# Altium schematic sheet 02 BLOCK DIAGRAM.SchDoc
size 513 x 386 mm
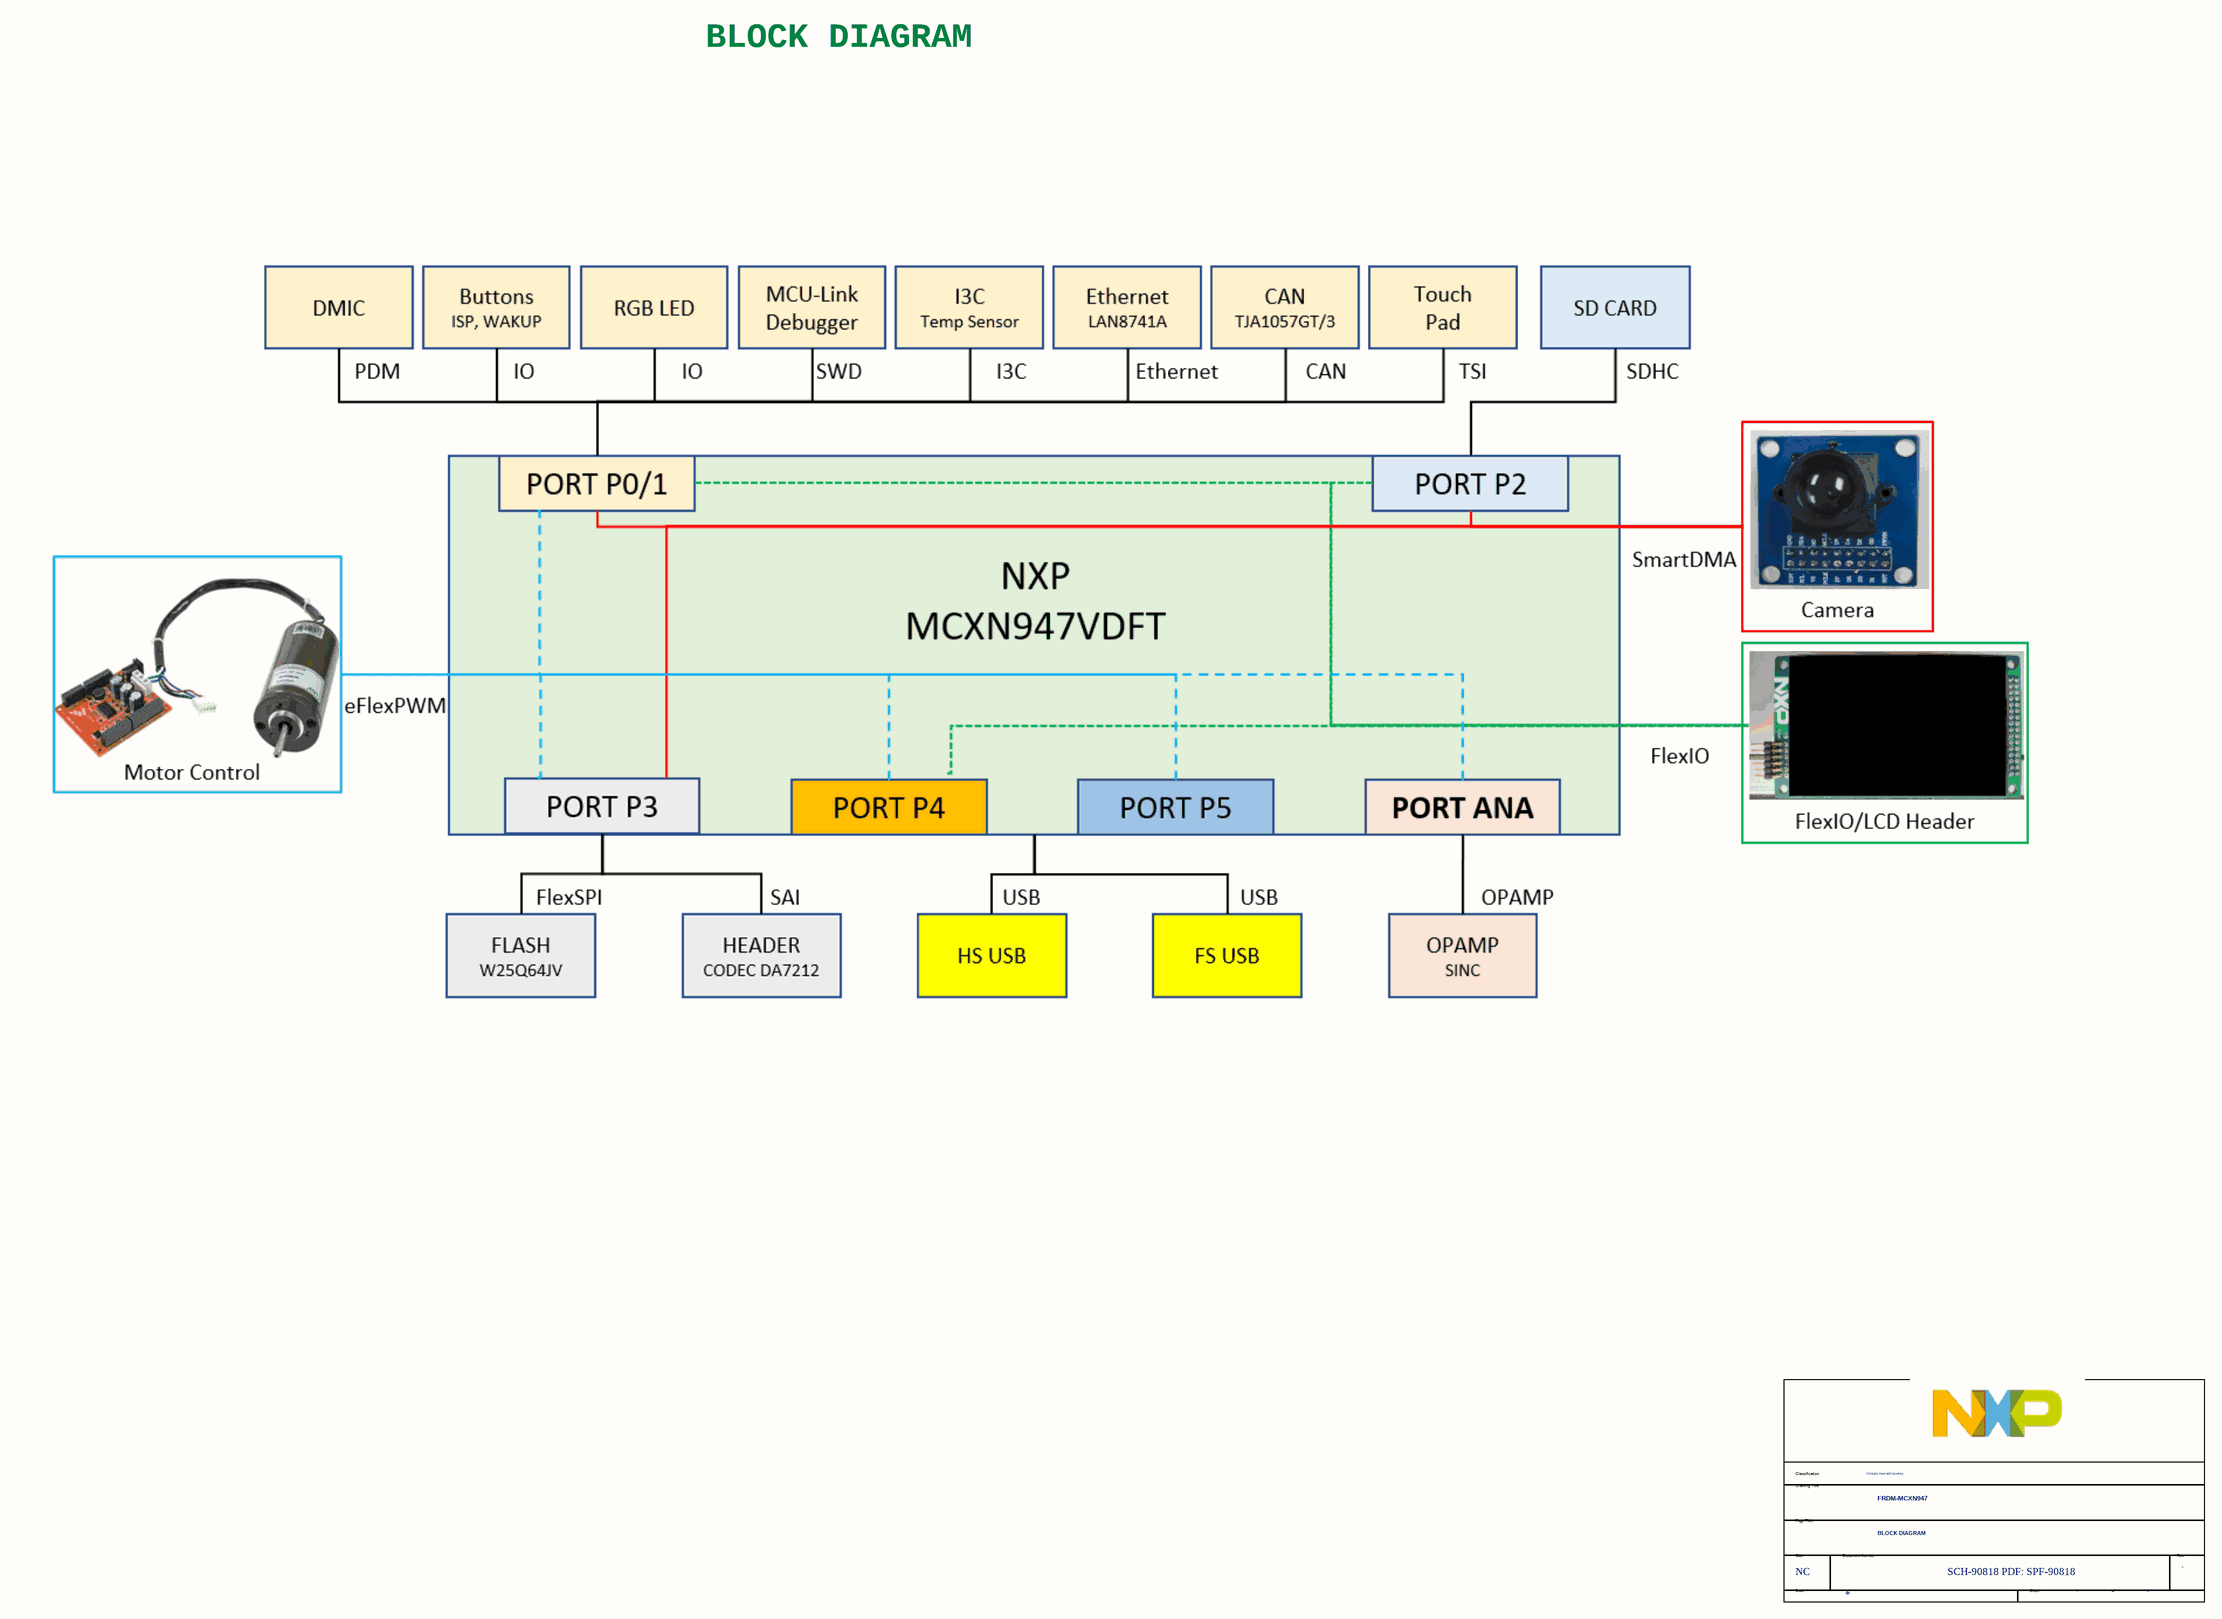
[diagram p0: 02 BLOCK DIAGRAM.SchDoc]

## Parts
*  Doc: SCH-90818 PDF: SPF-90818  RevCode: A  Title: FRDM-MCXN947  Page Size: NC  Page Number: 2  Page Count: 13  PageTitle: BLOCK DIAGRAM  Classification: Company Internal/Proprietary  (hidden comment: TitleBlock_FS)  (graphical)

## Notes on the sheet
- BLOCK DIAGRAM
- (in symbol TitleBlock_FS) Classification:; Drawing Title:; Page Title:; Size; Document Number; Rev; Date:; Sheet; of

## Library data of the parts
* = TitleBlock_FS: Classification: Public, Company Internal/Proprietary, Company Confidential,  Company Secret; OrgName: NXP Semiconductors; OrgAddr1: 6501 William Cannon Drive West; OrgAddr2: Austin, TX 78735-8598; Variant Name: <Core Design>; Page Create Date: March  8, 1995; Page Modify Date: *